# Altium schematic sheet uc2C.SchDoc: Microcontroller 3 (Part A)
size A4; Author: Marcel Hellwig; Organization: Hamburg Bit-Bots; Address1: Vogt-Kölln-Str. 30; Address2: 22527 Hamburg; Address3: Germany; Address4: www.bit-bots.de; DocumentNumber: 9; Revision: A; SheetNumber: 9; SheetTotal: 16; EMail: info@bit-bots.de
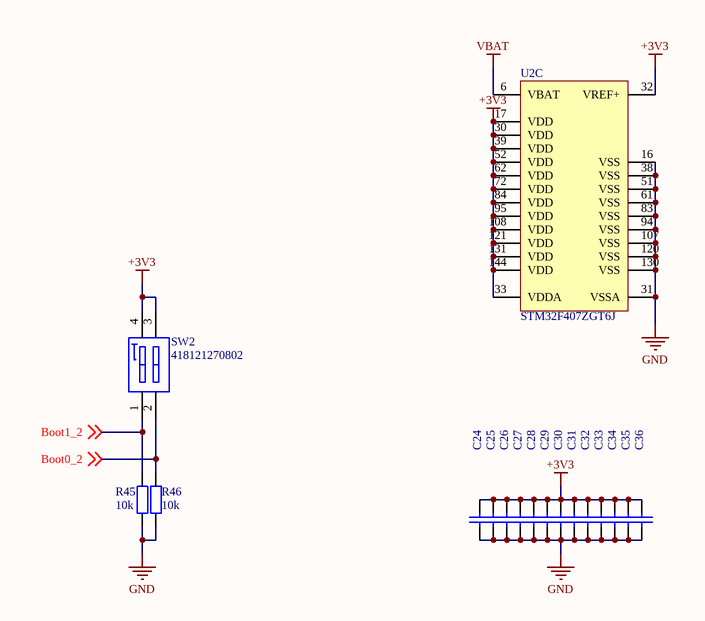
[diagram p0: uc2C.SchDoc]

## Parts
C24  100nF  [C2012]  (value not drawn)
C25  100nF  [C2012]  (value not drawn)
C26  100nF  [C2012]  (value not drawn)
C27  100nF  [C2012]  (value not drawn)
C28  100nF  [C2012]  (value not drawn)
C29  100nF  [C2012]  (value not drawn)
C30  100nF  [C2012]  (value not drawn)
C31  100nF  [C2012]  (value not drawn)
C32  100nF  [C2012]  (value not drawn)
C33  100nF  [C2012]  (value not drawn)
C34  100nF  [C2012]  (value not drawn)
C35  100nF  [C2012]  (value not drawn)
C36  100nF  [C2012]  (value not drawn)
R45  10k  [R2012]
R46  10k  [R2012]
SW2  418121270802  [418121270802]
U2  STM32F407ZGT6J  [STM-LQFP144_M]  (part C of 3)

## Nets
+3V3: C24.2 C25.2 C26.2 C27.2 C28.2 C29.2 C30.2 C31.2 C32.2 C33.2 C34.2 C35.2 C36.2 SW2.3 SW2.4 U2.17(VDD) U2.30(VDD) U2.32(VREF+) U2.33(VDDA) U2.39(VDD) U2.52(VDD) U2.62(VDD) U2.72(VDD) U2.84(VDD) U2.95(VDD) U2.108(VDD) U2.121(VDD) U2.131(VDD) U2.144(VDD)
GND: C24.1 C25.1 C26.1 C27.1 C28.1 C29.1 C30.1 C31.1 C32.1 C33.1 C34.1 C35.1 C36.1 R45.2 R46.1 U2.16(VSS) U2.31(VSSA) U2.38(VSS) U2.51(VSS) U2.61(VSS) U2.83(VSS) U2.94(VSS) U2.107(VSS) U2.120(VSS) U2.130(VSS)
VBAT: U2.6(VBAT)
Boot0_2: R46.2 SW2.2 ; off-sheet Boot0_2
Boot1_2: R45.1 SW2.1 ; off-sheet Boot1_2

## Notes on the sheet
- Project:
- Author:
- Title:
- Rev:
- Date:
- Time:
- Sheet
- of

## Library data of the parts
C24-C36 = Cap: Capacitor; Manufacturer: MULTICOMP; Manufacturer Part Number: MC0805B104K500CT; Produktpalette: Baureihe MC; Kapazität: 0.1; Kapazitätstoleranz: ±10%; Dielektrikum: X7; Nennspannung: 50; Keramikkondensatorgehäuse: 0805 [Metrisch 2012]; Betriebstemperatur, min.: -55; Betriebstemperatur, max.: 125; Verpackung: Gurtabschnitt; SVHC: No SVHC (17-Dec-2014); Betriebstemperatur: -55°C bis +125; Kondensatoranschlüsse: SMD<!--FANDB--><div class="features-and-benefits-container"></div>; Published: 8-Jun-2000; LatestRevisionDate: 17-Jul-2002; LatestRevisionNote: Re-released for DXP Platform.; PackageReference: RAD-0.3; Publisher: Altium Limited; PackageDescription: Radial Cap, Thru-Hole; 2 Leads; 0.3 in Pin Spacing; Value: 100nF; Supplier 1: Farnell; Supplier Part Number 1: 1759265; RoHS: YES; Stock 1: 692587; Pricing 1: 10=0,013, 100=0,011, 500=0,009, 1000=0,008, 2000=0,006 (EUR); MSL: -; Bauform: 0805 [Metrisch 2012]; Kapazitätstoleranz ±: ±10%; ComponentLink1URL: http://www.farnell.com/datasheets/1870456.pdf; ComponentLink1Description: http://www.farnell.com/datasheets/1870456.pdf
R45 R46 = Res2: Resistor; Manufacturer: MULTICOMP; Manufacturer Part Number: MC01W0805110K; Published: 8-Jun-2000; LatestRevisionDate: 17-Jul-2002; LatestRevisionNote: Re-released for DXP Platform.; PackageReference: AXIAL-0.4; Publisher: Altium Limited; PackageDescription: Axial Device, Thru-Hole; 2 Leads; 0.4 in Pin Spacing; Value: 10k; Supplier 1: Farnell; Supplier Part Number 1: 9332391; RoHS: Y-EX; Stock 1: 4370; Pricing 1: 50=0,038, 250=0,031, 1000=0,022, 5000=0,014, 15000=0,009 (EUR); ComponentLink1URL: http://www.farnell.com/datasheets/1729047.pdf; ComponentLink1Description: http://www.farnell.com/datasheets/1729047.pdf; ComponentLink2URL: http://www.farnell.com/cad/1561156.zip; ComponentLink2Description: http://www.farnell.com/cad/1561156.zip
SW2 = CMP-1438-00002-1: WS-DISV 2.54 mm small compact SMD Dip Switch with raised actuator; Manufacturer: Wuerth Elektronik; Manufacturer Part Number: A6S2104H; NoPins: 04; ComponentLink2URL: http://katalog.we-online.de/em/datasheet/4181212708xx.pdf; ComponentLink2Description: Datasheet; PackageReference: 418121270802; ComponentLink1Description: Manufacturer URL; PartNumber: 418121270802; ComponentLink1URL: http://www.we-online.com; Supplier 1: Farnell; Supplier Part Number 1: 1960894; RoHS: YES; Pricing 1: 1=1,79, 10=1,49, 25=1,23, 50=1,01, 100=0,921, 200=0,821, 500=0,651, 2000=0,625 (EUR); ComponentLink3URL: http://www.farnell.com/datasheets/1763372.pdf; ComponentLink3Description: http://www.farnell.com/datasheets/1763372.pdf
U2 = CMP-0243-00063-2: ARM Cortex-M4 32-bit MCU+FPU, 210 DMIPS, 1024 kB Flash, 192 kB Internal RAM, 114 I/Os, 144-pin LQFP, -40 to 85 degC, Tray; Manufacturer: STMicroelectronics; I/Os (High Current): 114; D/A Converter: 2x12-bit; Internal RAM Size (kB): 192; Operating Frequency(F) (Processor speed) (MHz): 168; Supply Voltage(Vcc) max (V): 3.6; Supply Voltage(Vcc) min (V): 1.8; FLASH Size (Prog) (kB): 1024; ComponentLink3Description: Package Specification; PackageVersion: Rev. 4, 06/2013; PartNumber: STM32F407ZGT6J; ComponentLink3URL: http://www.st.com/st-web-ui/static/active/en/resource/technical/document/datasheet/DM00037051.pdf; PackageReference: LQFP144; ComponentLink2URL: http://www.st.com/st-web-ui/static/active/en/resource/technical/document/datasheet/DM00037051.pdf; ComponentLink2Description: Datasheet; ComponentLink1Description: Manufacturer URL; Mounting Technology: Surface Mount; Core: ARM Cortex-M4; PackageDescription: 144-Pin Low Profile Quad Flat Package, 20 x 20 mm Body, 0.5 mm Pitch; Packing: Tray; ComponentLink1URL: http://www.st.com/web/en/home.html; DatasheetVersion: Rev. 4; PartId: 1; Supplier 1: Farnell; Supplier Part Number 1: 2333299